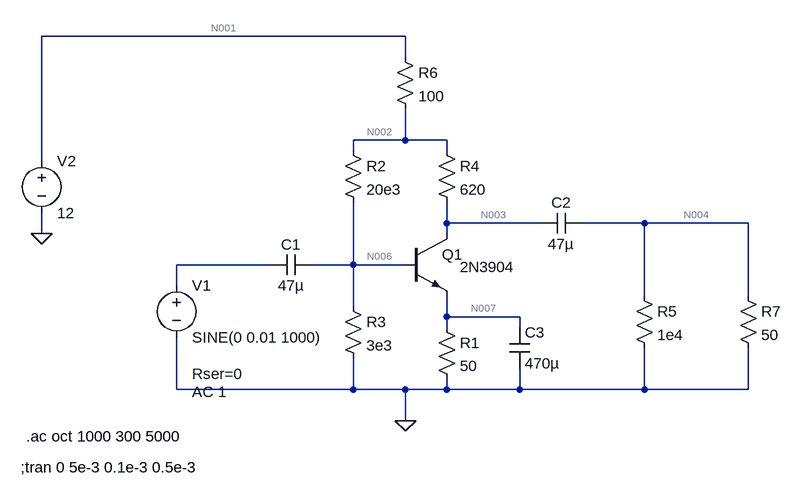
[diagram p0: schematic audio_amp_mic.asc]
audio_amp_mic.asc, the LTspice schematic file:
Version 4
SHEET 1 924 680
WIRE 176 -192 -384 -192
WIRE 176 -160 176 -192
WIRE 176 -32 176 -80
WIRE 176 -32 96 -32
WIRE 240 -32 176 -32
WIRE 96 -16 96 -32
WIRE 240 -16 240 -32
WIRE -384 0 -384 -192
WIRE 240 96 240 64
WIRE 384 96 240 96
WIRE 544 96 448 96
WIRE 704 96 544 96
WIRE -384 112 -384 80
WIRE 240 112 240 96
WIRE -32 160 -176 160
WIRE 96 160 96 64
WIRE 96 160 32 160
WIRE 176 160 96 160
WIRE -176 192 -176 160
WIRE 544 208 544 96
WIRE 704 208 704 96
WIRE 96 224 96 160
WIRE 240 240 240 208
WIRE 352 240 240 240
WIRE 240 256 240 240
WIRE 352 256 352 240
WIRE -176 352 -176 272
WIRE 96 352 96 304
WIRE 96 352 -176 352
WIRE 176 352 96 352
WIRE 240 352 240 336
WIRE 240 352 176 352
WIRE 352 352 352 320
WIRE 352 352 240 352
WIRE 544 352 544 288
WIRE 544 352 352 352
WIRE 704 352 704 288
WIRE 704 352 544 352
WIRE 176 400 176 352
FLAG 176 400 0
FLAG -384 112 0
SYMBOL npn 176 112 R0
WINDOW 3 84 51 Left 2
SYMATTR InstName Q1
SYMATTR Value 2N3904
SYMBOL voltage -176 176 R0
WINDOW 123 24 180 Left 2
WINDOW 39 24 152 Left 2
SYMATTR InstName V1
SYMATTR Value SINE(0 0.01 1000)
SYMATTR Value2 AC 1
SYMATTR SpiceLine Rser=0
SYMBOL voltage -384 -16 R0
WINDOW 123 0 0 Left 0
WINDOW 39 0 0 Left 0
SYMATTR InstName V2
SYMATTR Value 12
SYMBOL cap 32 144 R90
WINDOW 0 0 32 VBottom 2
WINDOW 3 32 32 VTop 2
SYMATTR InstName C1
SYMATTR Value 47µ
SYMBOL cap 448 80 R90
WINDOW 0 0 32 VBottom 2
WINDOW 3 32 32 VTop 2
SYMATTR InstName C2
SYMATTR Value 47µ
SYMBOL res 224 240 R0
SYMATTR InstName R1
SYMATTR Value 50
SYMBOL res 80 -32 R0
SYMATTR InstName R2
SYMATTR Value 20e3
SYMBOL res 80 208 R0
SYMATTR InstName R3
SYMATTR Value 3e3
SYMBOL res 224 -32 R0
SYMATTR InstName R4
SYMATTR Value 620
SYMBOL res 528 192 R0
SYMATTR InstName R5
SYMATTR Value 1e4
SYMBOL cap 336 256 R0
SYMATTR InstName C3
SYMATTR Value 470µ
SYMBOL res 160 -176 R0
SYMATTR InstName R6
SYMATTR Value 100
SYMBOL res 688 192 R0
SYMATTR InstName R7
SYMATTR Value 50
TEXT -416 472 Left 2 !;tran 0 5e-3 0.1e-3 0.5e-3
TEXT -408 424 Left 2 !.ac oct 1000 300 5000

The netlist it stands for:
* audio_amp_mic.asc
Q1 N003 N006 N007 0 2N3904
V1 N005 0 SINE(0 0.01 1000) AC 1 Rser=0
V2 N001 0 12
C1 N006 N005 47µ
C2 N004 N003 47µ
R1 N007 0 50
R2 N002 N006 20e3
R3 N006 0 3e3
R4 N002 N003 620
R5 N004 0 1e4
C3 N007 0 470µ
R6 N001 N002 100
R7 N004 0 50
.model NPN NPN
.model PNP PNP
.lib standard.bjt
;tran 0 5e-3 0.1e-3 0.5e-3
.ac oct 1000 300 5000
.backanno
.end

* Results of the author's LTspice run, read from the files saved beside the schematic
* Operating Point, zero values left out:
*   V(n003) = 3.564 V
*   V(n006) = 1.305 V
*   V(n007) = 584.5 mV
*   V(n001) = 12 V
*   V(n002) = 10.79 V
*   Ic(Q1) = 11.65 mA
*   Ib(Q1) = 39.06 µA
*   Ie(Q1) = -11.69 mA
*   I(R6) = 12.12 mA
*   I(R4) = 11.65 mA
*   I(R3) = 435.1 µA
*   I(R2) = 474.1 µA
*   I(R1) = 11.69 mA
*   I(V2) = -12.12 mA
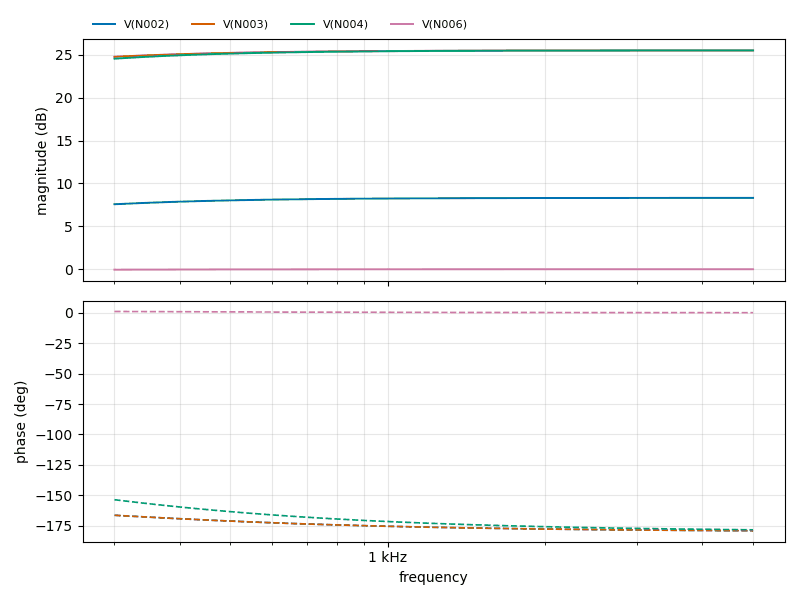
[diagram p1: AC Analysis of audio_amp_mic.asc, plotted from the saved traces]
* AC Analysis, 1 run:
*   V(N002): 7.58 dB at 300 Hz, 8.32 dB at 5 kHz, peak 8.32 dB at 5 kHz
*   V(N003): 24.77 dB at 300 Hz, 25.52 dB at 5 kHz, peak 25.52 dB at 5 kHz
*   V(N004): 24.56 dB at 300 Hz, 25.52 dB at 5 kHz, peak 25.52 dB at 5 kHz
*   V(N006): -0.06 dB at 300 Hz, -0.00 dB at 5 kHz, peak -0.00 dB at 5 kHz